# Altium schematic sheet Smart_Lock_Schematic.SchDoc
size A4
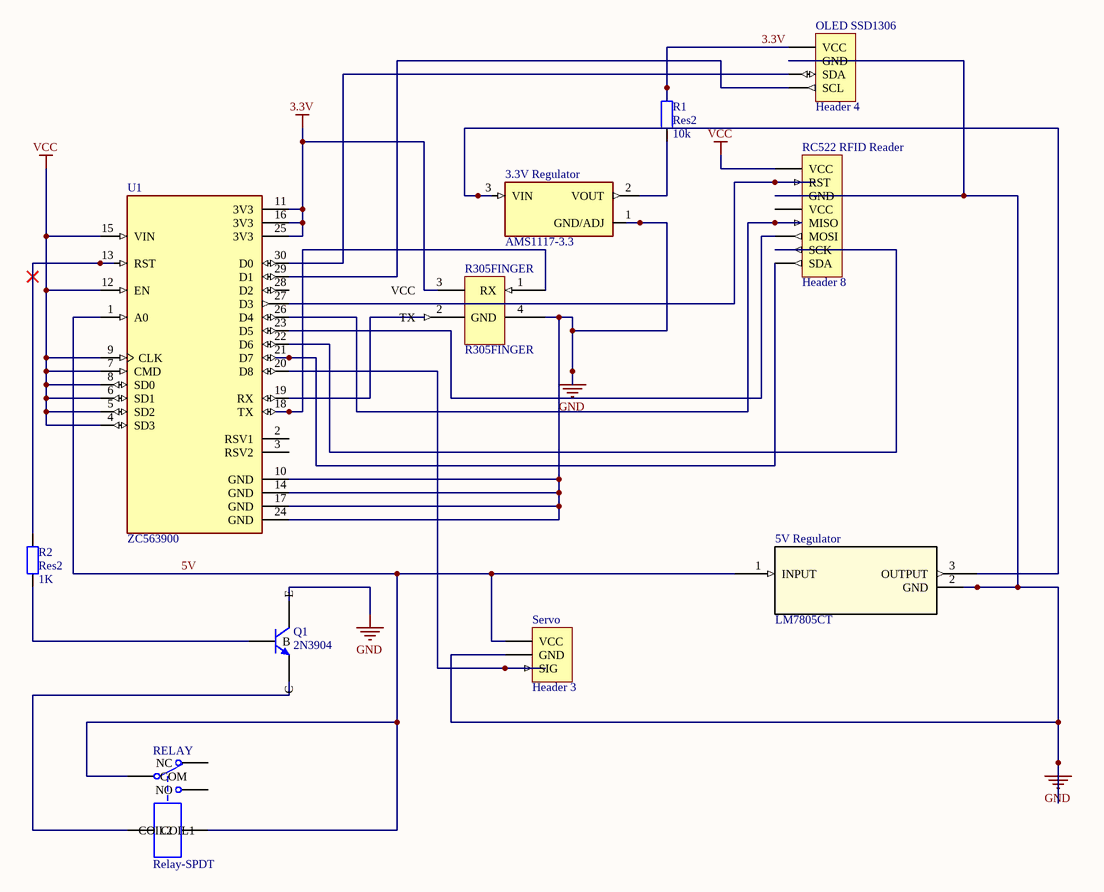
[diagram p0: Smart_Lock_Schematic.SchDoc]

## Parts
3.3V_Regulator  AMS1117-3.3  [SOT229P700X180-4N]
5V_Regulator  LM7805CT  [TO220-3_ONS]
OLED_SSD1306  Header 4  [HDR1X4]
Q1  2N3904  [TO-92A]
R1  Res2  value 10k  [AXIAL-0.4]
R2  Res2  value 1K  [AXIAL-0.4]
R305FINGER  R305FINGER
RC522_RFID_Reader  Header 8  [HDR1X8]
RELAY  Relay-SPDT  [MODULE5B]
Servo  Header 3  [HDR1X3]
U1  ZC563900  [MODULE_ZC563900]

## Nets
3.3V: OLED_SSD1306.1(VCC) R1.2 U1.11(3V3) U1.16(3V3) U1.25(3V3)
GND: 3.3V_Regulator.1(GND/ADJ) 5V_Regulator.2(GND) OLED_SSD1306.2(GND) Q1.3(C) R305FINGER.4(GND) RC522_RFID_Reader.3(GND) Servo.2(GND) U1.10(GND) U1.14(GND) U1.17(GND) U1.24(GND)
VCC: RC522_RFID_Reader.1(VCC) U1.4(SD3) U1.5(SD2) U1.6(SD1) U1.7(CMD) U1.8(SD0) U1.9(CLK) U1.12(EN) U1.15(VIN)
5V: 5V_Regulator.1(INPUT) RELAY.1(COM) RELAY.5(COIL2) Servo.1(VCC) U1.1(A0)
Net3.3V_Regulator_2: 3.3V_Regulator.2(VOUT) R1.1
Net3.3V_Regulator_3: 3.3V_Regulator.3(VIN) 5V_Regulator.3(OUTPUT)
NetOLED_SSD1306_3: OLED_SSD1306.3(SDA) U1.30(D0)
NetOLED_SSD1306_4: OLED_SSD1306.4(SCL) U1.29(D1)
NetQ1_1: Q1.1(E) RELAY.4(COIL1)
NetQ1_2: Q1.2(B) R2.1
NetR2_2: R2.2 U1.13(RST)
NetR305FINGER_1: R305FINGER.1(RX) U1.18(TX)
NetRC522_RFID_Reader_2: RC522_RFID_Reader.2(RST) U1.27(D3)
NetRC522_RFID_Reader_5: RC522_RFID_Reader.5(MISO) U1.26(D4)
NetRC522_RFID_Reader_6: RC522_RFID_Reader.6(MOSI) U1.23(D5)
NetRC522_RFID_Reader_7: RC522_RFID_Reader.7(SCK) U1.22(D6)
NetRC522_RFID_Reader_8: RC522_RFID_Reader.8(SDA) U1.21(D7)
NetServo_3: Servo.3(SIG) U1.20(D8)

Not connected (* = marked no-connect by the designer): R305FINGER 2(TX) 3(VCC); RC522_RFID_Reader 4(VCC); RELAY 2(NC) 3(NO); U1 2(RSV1) 3(RSV2) 19(RX) 28(D2)

## Library data of the parts
3.3V_Regulator = AMS1117-3.3: Sot223/Pkg 1-Amp 3.3-Volt Low Drop Out Voltage Regulatator; MF: Advanced Monolithic Systems; SnapEDA_Link: https://www.snapeda.com/parts/AMS1117-3.3/Advanced+Monolithic+Systems/view-part/?ref=snap; Package: SOT-223 Seeed Technology; Value: *; MP: AMS1117-3.3; Check_prices: https://www.snapeda.com/parts/AMS1117-3.3/Advanced+Monolithic+Systems/view-part/?ref=eda
5V_Regulator = LM7805CT: No Description Available; Mfr_Name: onsemi; RefDes: RefDes; Type: Type
OLED_SSD1306 = Header 4: Header, 4-Pin; LatestRevisionDate: 17-Jul-2002; LatestRevisionNote: Re-released for DXP Platform.; Publisher: Altium Limited
Q1 = 2N3904: NPN General Purpose Amplifier; Published: 8-Jun-2000; LatestRevisionDate: 15-Jan-2003; LatestRevisionNote: PCB Footprint 'BCY-W3/D4.7' replaced; DatasheetVersion: 1997; PackageVersion: Sep-1998; PackageReference: TO-92A; Publisher: Altium Limited; PackageDescription: TO, Flat Index; 3 In-Line, Axial Leads; Body Dia. 4.5mm; Leads 0.51 x 0.48 mm (max); ComponentLink1Description: Manufacturer Link; ComponentLink1URL: http://www.fairchildsemi.com/; ComponentLink2Description: Datasheet; ComponentLink2URL: http://www.fairchildsemi.com/ds/2N%2F2N3904.pdf
R1 R2 = Res2: Resistor; Published: 8-Jun-2000; LatestRevisionDate: 17-Jul-2002; LatestRevisionNote: Re-released for DXP Platform.; PackageReference: AXIAL-0.4; Publisher: Altium Limited; PackageDescription: Axial Device, Thru-Hole; 2 Leads; 0.4 in Pin Spacing
RC522_RFID_Reader = Header 8: Header, 8-Pin; LatestRevisionDate: 17-Jul-2002; LatestRevisionNote: Re-released for DXP Platform.; Publisher: Altium Limited
RELAY = Relay-SPDT: Single-Pole Dual-Throw Relay; Published: 24-Mar-1999; LatestRevisionDate: 17-Jul-2002; LatestRevisionNote: Re-released for DXP Platform.; PackageReference: MODULE5B; Publisher: Altium Limited
Servo = Header 3: Header, 3-Pin; LatestRevisionDate: 17-Jul-2002; LatestRevisionNote: Re-released for DXP Platform.; Publisher: Altium Limited
U1 = ZC563900: NodeMcu Lua ESP8266 WIFI Internet of Things Network Development Module Board; MF: YKS; Value: *; SnapEDA_Link: https://www.snapeda.com/parts/ZC563900/YKS/view-part/?ref=snap; Availability: Not in stock; Price: None; Package: None; Check_prices: https://www.snapeda.com/parts/ZC563900/YKS/view-part/?ref=eda; MP: ZC563900